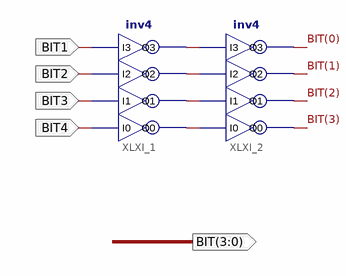
[diagram p0: schematic sheet 1]
// Xilinx ISE schematic MixBus4_1.sch (spartan6) as structural Verilog: 2 symbols, 5 ports
module MixBus4_1 (
  input  BIT1,
  input  BIT2,
  input  BIT3,
  input  BIT4,
  output [3:0] BIT
);

  wire XLXN_1, XLXN_2, XLXN_3, XLXN_4;

  inv4 XLXI_1 (.I0(BIT4), .I1(BIT3), .I2(BIT2), .I3(BIT1), .O0(XLXN_1), .O1(XLXN_2), .O2(XLXN_3), .O3(XLXN_4));
  inv4 XLXI_2 (.I0(XLXN_1), .I1(XLXN_2), .I2(XLXN_3), .I3(XLXN_4), .O0(BIT[3]), .O1(BIT[2]), .O2(BIT[1]), .O3(BIT[0]));
endmodule
